# Altium schematic sheet OBDH_Interface_top.SchDoc: FloripaSat / OBDHTTC Subsystem /  OBDHTTC Peripherals
size A3; SheetNumber: 1; SheetTotal: 11
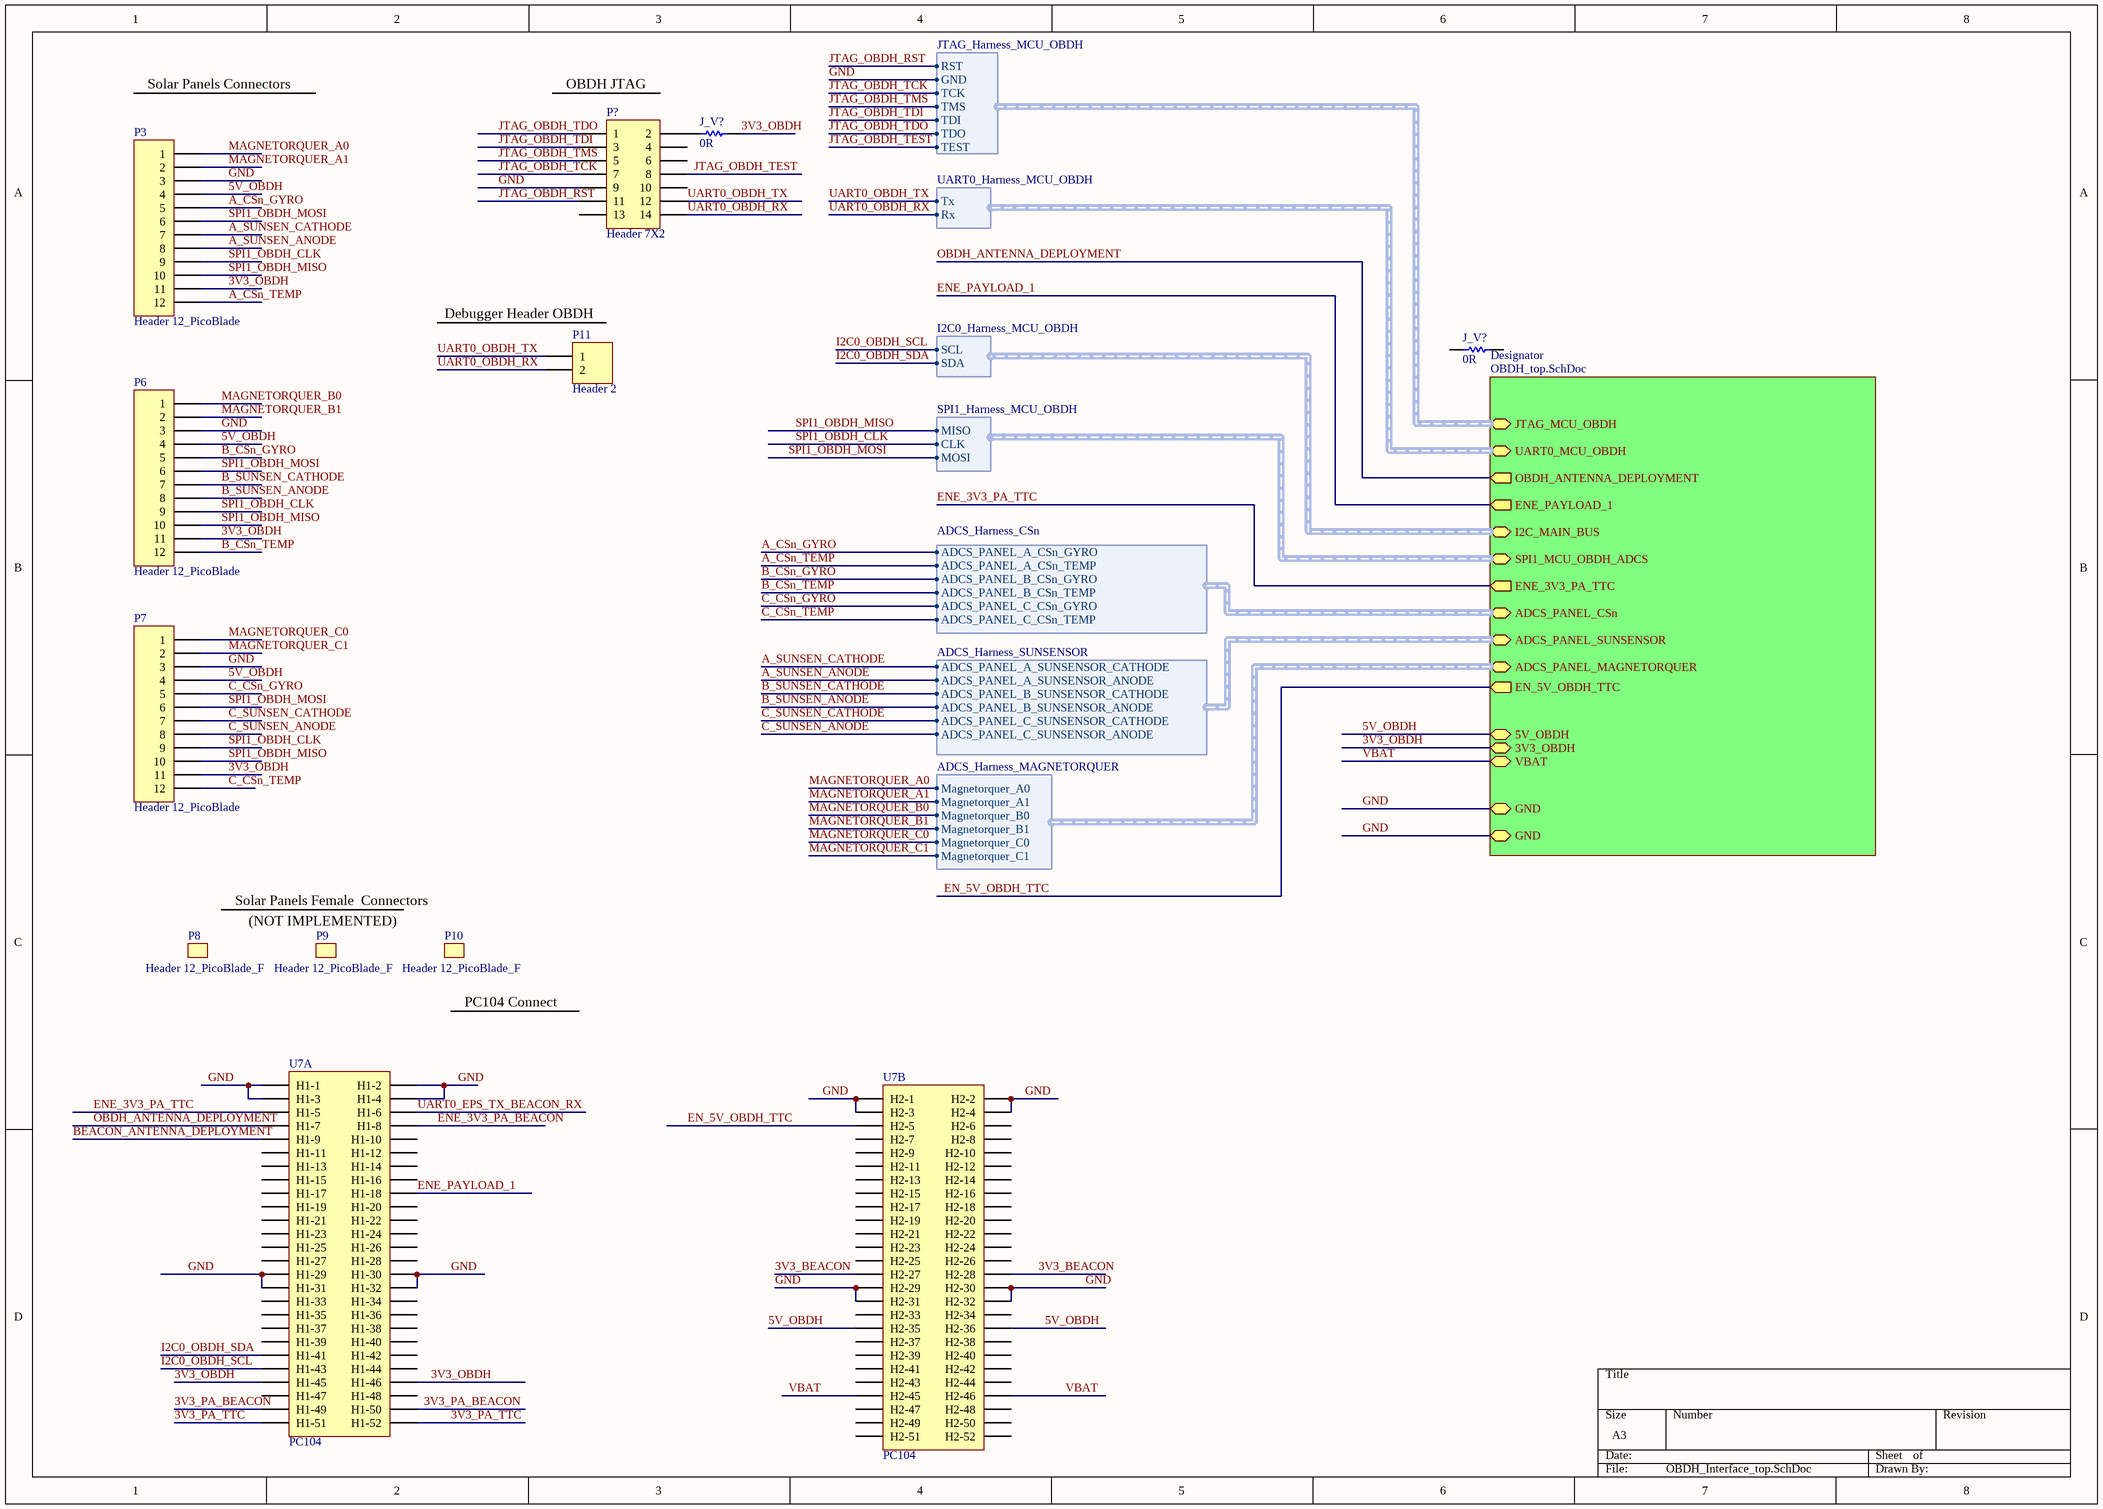
[diagram p0: OBDH_Interface_top.SchDoc]

## Parts
(Parts that share a designator on the sheet are numbered #1, #2 ... from top to bottom, then left to right.)
J_V?#1  0R  [0805]
J_V?#2  0R  [0805]
P3  Header 12_PicoBlade  [HDR12 PicoBlade - duplicate]
P6  Header 12_PicoBlade  [HDR12 PicoBlade - duplicate]
P7  Header 12_PicoBlade  [HDR12 PicoBlade - duplicate]
P8  Header 12_PicoBlade_F
P9  Header 12_PicoBlade_F
P10  Header 12_PicoBlade_F
P11  Header 2  [HDR 1X2]
P?  Header 7X2  [HDR2X7]
U7  PC104  [PC104]  (parts A,B of 2)

## Sub-sheets
Designator = OBDH_top.SchDoc: JTAG_MCU_OBDH (harness JTAG_Harness_MCU_OBDH), I2C_MAIN_BUS (harness I2C0_Harness_MCU_OBDH), 3V3_OBDH, GND, GND, OBDH_ANTENNA_DEPLOYMENT (out), ENE_PAYLOAD_1 (out), UART0_MCU_OBDH (harness UART0_Harness_MCU_OBDH), SPI1_MCU_OBDH_ADCS (harness SPI1_Harness_MCU_OBDH), ENE_3V3_PA_TTC (out), ADCS_PANEL_CSn (harness ADCS_Harness_CSn), ADCS_PANEL_SUNSENSOR (harness ADCS_Harness_SUNSENSOR), ADCS_PANEL_MAGNETORQUER (harness ADCS_Harness_MAGNETORQUER), 5V_OBDH, EN_5V_OBDH_TTC (out), VBAT

## Harnesses
JTAG_Harness_MCU_OBDH: TDO, TDI, TMS, TCK, RST, GND, TEST
I2C0_Harness_MCU_OBDH: SDA, SCL
UART0_Harness_MCU_OBDH: Rx, Tx
SPI1_Harness_MCU_OBDH: CLK, MISO, MOSI
ADCS_Harness_CSn: ADCS_PANEL_A_CSn_GYRO, ADCS_PANEL_A_CSn_TEMP, ADCS_PANEL_B_CSn_GYRO, ADCS_PANEL_B_CSn_TEMP, ADCS_PANEL_C_CSn_GYRO, ADCS_PANEL_C_CSn_TEMP
ADCS_Harness_SUNSENSOR: ADCS_PANEL_C_SUNSENSOR_ANODE, ADCS_PANEL_C_SUNSENSOR_CATHODE, ADCS_PANEL_B_SUNSENSOR_ANODE, ADCS_PANEL_B_SUNSENSOR_CATHODE, ADCS_PANEL_A_SUNSENSOR_ANODE, ADCS_PANEL_A_SUNSENSOR_CATHODE
ADCS_Harness_MAGNETORQUER: Magnetorquer_A0, Magnetorquer_A1, Magnetorquer_B0, Magnetorquer_B1, Magnetorquer_C0, Magnetorquer_C1

## Nets
3V3_BEACON: U7.H2-27 U7.H2-28
3V3_OBDH: J_V?#1.1 P3.11 P6.11 P7.11 U7.H1-45 U7.H1-46 ; sheet Designator/3V3_OBDH
3V3_PA_BEACON: U7.H1-49 U7.H1-50
3V3_PA_TTC: U7.H1-51 U7.H1-52
5V_OBDH: P3.4 P6.4 P7.4 U7.H2-35 U7.H2-36 ; sheet Designator/5V_OBDH
A_CSn_GYRO: P3.5 ; sheet Designator/ADCS_PANEL_CSn.ADCS_PANEL_A_CSn_GYRO
A_CSn_TEMP: P3.12 ; sheet Designator/ADCS_PANEL_CSn.ADCS_PANEL_A_CSn_TEMP
A_SUNSEN_ANODE: P3.8 ; sheet Designator/ADCS_PANEL_SUNSENSOR.ADCS_PANEL_A_SUNSENSOR_ANODE
A_SUNSEN_CATHODE: P3.7 ; sheet Designator/ADCS_PANEL_SUNSENSOR.ADCS_PANEL_A_SUNSENSOR_CATHODE
B_CSn_GYRO: P6.5 ; sheet Designator/ADCS_PANEL_CSn.ADCS_PANEL_B_CSn_GYRO
B_CSn_TEMP: P6.12 ; sheet Designator/ADCS_PANEL_CSn.ADCS_PANEL_B_CSn_TEMP
B_SUNSEN_ANODE: P6.8 ; sheet Designator/ADCS_PANEL_SUNSENSOR.ADCS_PANEL_B_SUNSENSOR_ANODE
B_SUNSEN_CATHODE: P6.7 ; sheet Designator/ADCS_PANEL_SUNSENSOR.ADCS_PANEL_B_SUNSENSOR_CATHODE
BEACON_ANTENNA_DEPLOYMENT: U7.H1-9
C_CSn_GYRO: P7.5 ; sheet Designator/ADCS_PANEL_CSn.ADCS_PANEL_C_CSn_GYRO
C_CSn_TEMP: P7.12 ; sheet Designator/ADCS_PANEL_CSn.ADCS_PANEL_C_CSn_TEMP
C_SUNSEN_ANODE: P7.8 ; sheet Designator/ADCS_PANEL_SUNSENSOR.ADCS_PANEL_C_SUNSENSOR_ANODE
C_SUNSEN_CATHODE: P7.7 ; sheet Designator/ADCS_PANEL_SUNSENSOR.ADCS_PANEL_C_SUNSENSOR_CATHODE
EN_5V_OBDH_TTC: U7.H2-5 ; sheet Designator/EN_5V_OBDH_TTC
ENE_3V3_PA_BEACON: U7.H1-8
ENE_3V3_PA_TTC: U7.H1-5 ; sheet Designator/ENE_3V3_PA_TTC
ENE_PAYLOAD_1: U7.H1-18 ; sheet Designator/ENE_PAYLOAD_1
GND: P3.3 P6.3 P7.3 P?.9 U7.H1-1 U7.H1-2 U7.H1-3 U7.H1-4 U7.H1-29 U7.H1-30 U7.H1-31 U7.H1-32 U7.H2-1 U7.H2-2 U7.H2-3 U7.H2-4 U7.H2-29 U7.H2-30 U7.H2-31 U7.H2-32 ; sheet Designator/GND, sheet Designator/GND, sheet Designator/JTAG_MCU_OBDH.GND
I2C0_OBDH_SCL: U7.H1-43 ; sheet Designator/I2C_MAIN_BUS.SCL
I2C0_OBDH_SDA: U7.H1-41 ; sheet Designator/I2C_MAIN_BUS.SDA
JTAG_OBDH_RST: P?.11 ; sheet Designator/JTAG_MCU_OBDH.RST
JTAG_OBDH_TCK: P?.7 ; sheet Designator/JTAG_MCU_OBDH.TCK
JTAG_OBDH_TDI: P?.3 ; sheet Designator/JTAG_MCU_OBDH.TDI
JTAG_OBDH_TDO: P?.1 ; sheet Designator/JTAG_MCU_OBDH.TDO
JTAG_OBDH_TEST: P?.8 ; sheet Designator/JTAG_MCU_OBDH.TEST
JTAG_OBDH_TMS: P?.5 ; sheet Designator/JTAG_MCU_OBDH.TMS
MAGNETORQUER_A0: P3.1 ; sheet Designator/ADCS_PANEL_MAGNETORQUER.Magnetorquer_A0
MAGNETORQUER_A1: P3.2 ; sheet Designator/ADCS_PANEL_MAGNETORQUER.Magnetorquer_A1
MAGNETORQUER_B0: P6.1 ; sheet Designator/ADCS_PANEL_MAGNETORQUER.Magnetorquer_B0
MAGNETORQUER_B1: P6.2 ; sheet Designator/ADCS_PANEL_MAGNETORQUER.Magnetorquer_B1
MAGNETORQUER_C0: P7.1 ; sheet Designator/ADCS_PANEL_MAGNETORQUER.Magnetorquer_C0
MAGNETORQUER_C1: P7.2 ; sheet Designator/ADCS_PANEL_MAGNETORQUER.Magnetorquer_C1
OBDH_ANTENNA_DEPLOYMENT: U7.H1-7 ; sheet Designator/OBDH_ANTENNA_DEPLOYMENT
SPI1_OBDH_CLK: P3.9 P6.9 P7.9 ; sheet Designator/SPI1_MCU_OBDH_ADCS.CLK
SPI1_OBDH_MISO: P3.10 P6.10 P7.10 ; sheet Designator/SPI1_MCU_OBDH_ADCS.MISO
SPI1_OBDH_MOSI: P3.6 P6.6 P7.6 ; sheet Designator/SPI1_MCU_OBDH_ADCS.MOSI
UART0_EPS_TX_BEACON_RX: U7.H1-6
UART0_OBDH_RX: P11.2 P?.14 ; sheet Designator/UART0_MCU_OBDH.Rx
UART0_OBDH_TX: P11.1 P?.12 ; sheet Designator/UART0_MCU_OBDH.Tx
VBAT: U7.H2-45 U7.H2-46 ; sheet Designator/VBAT
NetJ_V?#1_2: J_V?#1.2 P?.2

Not connected (* = marked no-connect by the designer): J_V?#2 1 2; P? 4 6 10 13; U7 H1-10 H1-11 H1-12 H1-13 H1-14 H1-15 H1-16 H1-17 H1-19 H1-20 H1-21 H1-22 H1-23 H1-24 H1-25 H1-26 H1-27 H1-28 H1-33 H1-34 H1-35 H1-36 H1-37 H1-38 H1-39 H1-40 H1-42 H1-44 H1-47 H1-48 H2-6 H2-7 H2-8 H2-9 H2-10 H2-11 H2-12 H2-13 H2-14 H2-15 H2-16 H2-17 H2-18 H2-19 H2-20 H2-21 H2-22 H2-23 H2-24 H2-25 H2-26 H2-33 H2-34 H2-37 H2-38 H2-39 H2-40 H2-41 H2-42 H2-43 H2-44 H2-47 H2-48 H2-49 H2-50 H2-51 H2-52

## Notes on the sheet
- Solar Panels Connectors
- (near P?) OBDH JTAG
- (near P11) Debugger Header OBDH
- Solar Panels Female  Connectors
- (near P9) (NOT IMPLEMENTED)
- PC104 Connect

## Library data of the parts
J_V?#1 J_V?#2 = R0R_JUMPER_1/16W_0805: RES 0R OHM 1/16W JUMPER 0805; Partnumber: CRCW08050000Z0EA; NCM: 8533.21.20
P3 P6 P7 = Header 12_PicoBlade: Header, 12-Pin; PartNumber: 53398-1271; LatestRevisionDate: 17-Jul-2002; LatestRevisionNote: Re-released for DXP Platform.; Publisher: Altium Limited
P8-P10 = Header 12_PicoBlade_Female: Headers & Wire Housings RECEPTACLE 12 POS; PartNumber: 51021-1200; LatestRevisionDate: 17-Jul-2002; LatestRevisionNote: Re-released for DXP Platform.; Publisher: Altium Limited
P11 = Header 2: Header, 2-Pin; PartNumber: 826646-2; LatestRevisionDate: 17-Jul-2002; LatestRevisionNote: Re-released for DXP Platform.; Publisher: Altium Limited
P? = Header 7X2: Header, 7-Pin, Dual row; LatestRevisionDate: 17-Jul-2002; LatestRevisionNote: Re-released for DXP Platform.; Publisher: Altium Limited
U7 = PC104: Partnumber: ESQ-126-39-G-D